# Altium project 003-00006.PrjPcb
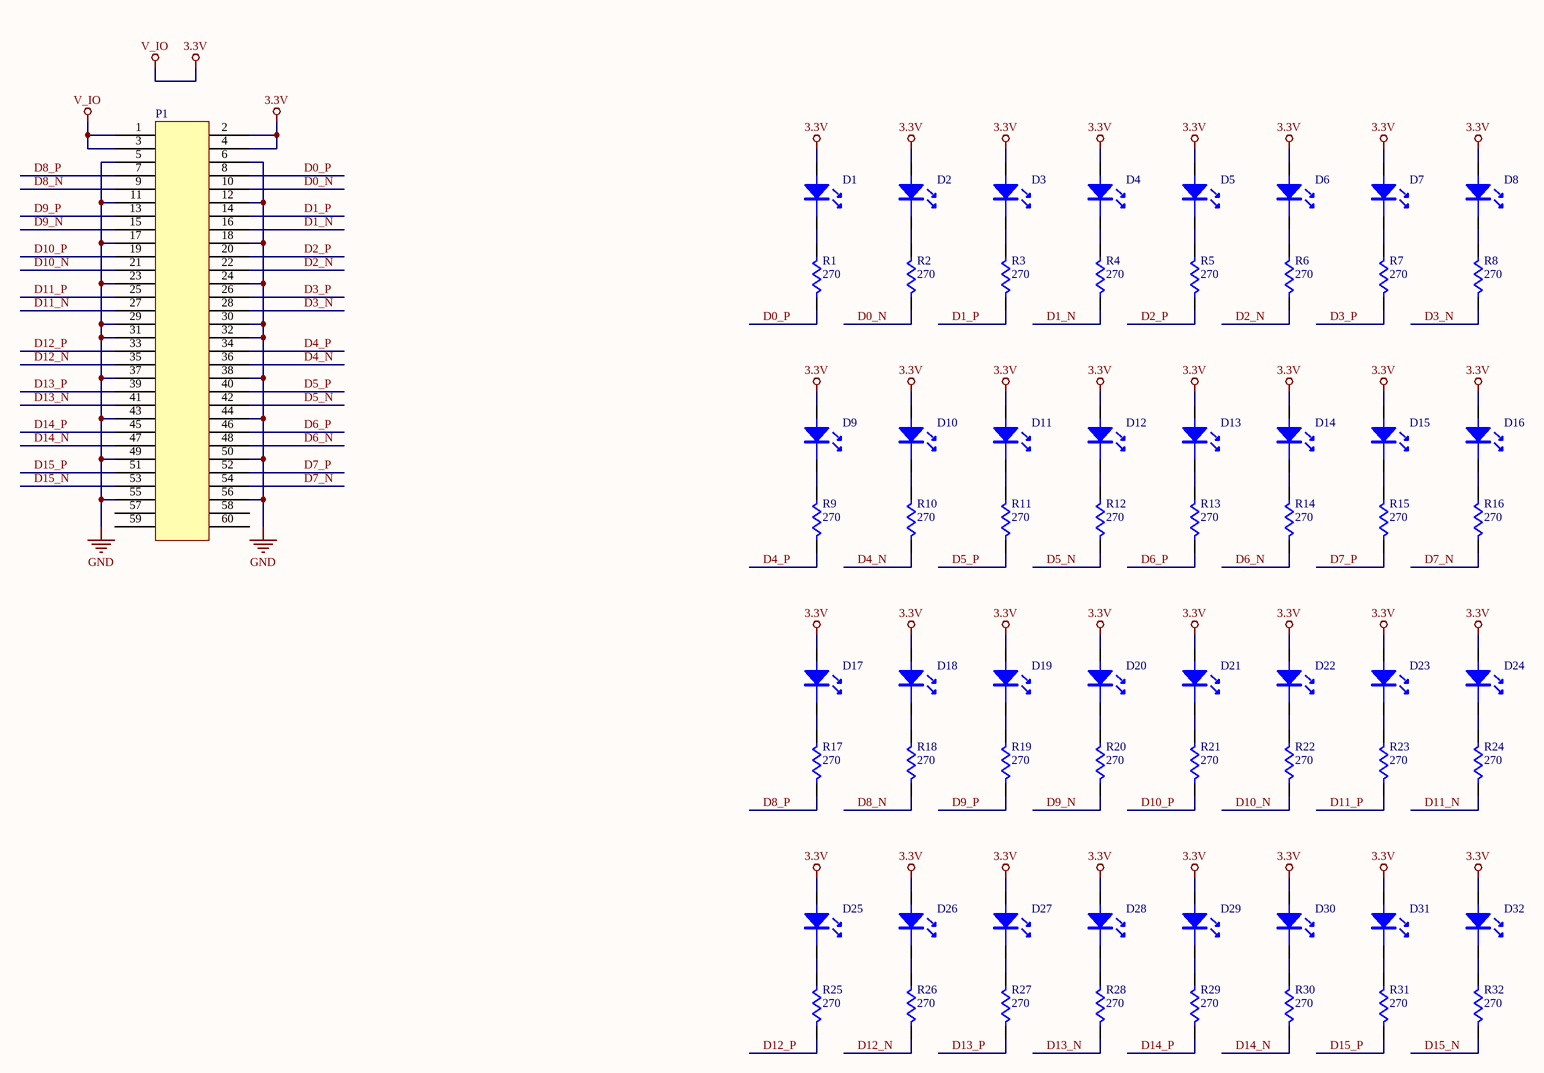
[diagram p0: 003-00006.SchDoc]
copyrightDate: 2014; DrillDrawingRevision: A; PCBPartNumber: 001-00006
1 sheet, 65 parts. Net scope: global (net labels, ports and power ports of the same name join across sheets).
Board file: 003-00006.PcbDoc

## Sheet 003-00006.SchDoc: <title>
size C; Organization: Custom Embedded Solutions, LLC.; Address1: 130 Oakland Trace; Address2: Madison, AL 35758; DocumentNumber: 1; Revision: <Rev>; SheetNumber: 1; SheetTotal: 5; PageTitle: Top Level (& only)

### Parts
D1  (no value)  [005-00018]
D2  (no value)  [005-00018]
D3  (no value)  [005-00018]
D4  (no value)  [005-00018]
D5  (no value)  [005-00018]
D6  (no value)  [005-00018]
D7  (no value)  [005-00018]
D8  (no value)  [005-00018]
D9  (no value)  [005-00018]
D10  (no value)  [005-00018]
D11  (no value)  [005-00018]
D12  (no value)  [005-00018]
D13  (no value)  [005-00018]
D14  (no value)  [005-00018]
D15  (no value)  [005-00018]
D16  (no value)  [005-00018]
D17  (no value)  [005-00018]
D18  (no value)  [005-00018]
D19  (no value)  [005-00018]
D20  (no value)  [005-00018]
D21  (no value)  [005-00018]
D22  (no value)  [005-00018]
D23  (no value)  [005-00018]
D24  (no value)  [005-00018]
D25  (no value)  [005-00018]
D26  (no value)  [005-00018]
D27  (no value)  [005-00018]
D28  (no value)  [005-00018]
D29  (no value)  [005-00018]
D30  (no value)  [005-00018]
D31  (no value)  [005-00018]
D32  (no value)  [005-00018]
P1  (no value)  [005-00024]  (no BOM)
R1  270  [005-00009]
R2  270  [005-00009]
R3  270  [005-00009]
R4  270  [005-00009]
R5  270  [005-00009]
R6  270  [005-00009]
R7  270  [005-00009]
R8  270  [005-00009]
R9  270  [005-00009]
R10  270  [005-00009]
R11  270  [005-00009]
R12  270  [005-00009]
R13  270  [005-00009]
R14  270  [005-00009]
R15  270  [005-00009]
R16  270  [005-00009]
R17  270  [005-00009]
R18  270  [005-00009]
R19  270  [005-00009]
R20  270  [005-00009]
R21  270  [005-00009]
R22  270  [005-00009]
R23  270  [005-00009]
R24  270  [005-00009]
R25  270  [005-00009]
R26  270  [005-00009]
R27  270  [005-00009]
R28  270  [005-00009]
R29  270  [005-00009]
R30  270  [005-00009]
R31  270  [005-00009]
R32  270  [005-00009]

### Nets
3.3V: D1.ANODE D2.ANODE D3.ANODE D4.ANODE D5.ANODE D6.ANODE D7.ANODE D8.ANODE D9.ANODE D10.ANODE D11.ANODE D12.ANODE D13.ANODE D14.ANODE D15.ANODE D16.ANODE D17.ANODE D18.ANODE D19.ANODE D20.ANODE D21.ANODE D22.ANODE D23.ANODE D24.ANODE D25.ANODE D26.ANODE D27.ANODE D28.ANODE D29.ANODE D30.ANODE D31.ANODE D32.ANODE P1.1 P1.2 P1.3 P1.4  [also labelled V_IO]
GND: P1.5 P1.6 P1.11 P1.12 P1.17 P1.18 P1.23 P1.24 P1.29 P1.30 P1.31 P1.32 P1.37 P1.38 P1.43 P1.44 P1.49 P1.50 P1.55 P1.56
D0_N: P1.10 R2.2
D0_P: P1.8 R1.2
D1_N: P1.16 R4.2
D1_P: P1.14 R3.2
D2_N: P1.22 R6.2
D2_P: P1.20 R5.2
D3_N: P1.28 R8.2
D3_P: P1.26 R7.2
D4_N: P1.36 R10.2
D4_P: P1.34 R9.2
D5_N: P1.42 R12.2
D5_P: P1.40 R11.2
D6_N: P1.48 R14.2
D6_P: P1.46 R13.2
D7_N: P1.54 R16.2
D7_P: P1.52 R15.2
D8_N: P1.9 R18.2
D8_P: P1.7 R17.2
D9_N: P1.15 R20.2
D9_P: P1.13 R19.2
D10_N: P1.21 R22.2
D10_P: P1.19 R21.2
D11_N: P1.27 R24.2
D11_P: P1.25 R23.2
D12_N: P1.35 R26.2
D12_P: P1.33 R25.2
D13_N: P1.41 R28.2
D13_P: P1.39 R27.2
D14_N: P1.47 R30.2
D14_P: P1.45 R29.2
D15_N: P1.53 R32.2
D15_P: P1.51 R31.2
NetD1_CATHODE: D1.CATHODE R1.1
NetD2_CATHODE: D2.CATHODE R2.1
NetD3_CATHODE: D3.CATHODE R3.1
NetD4_CATHODE: D4.CATHODE R4.1
NetD5_CATHODE: D5.CATHODE R5.1
NetD6_CATHODE: D6.CATHODE R6.1
NetD7_CATHODE: D7.CATHODE R7.1
NetD8_CATHODE: D8.CATHODE R8.1
NetD9_CATHODE: D9.CATHODE R9.1
NetD10_CATHODE: D10.CATHODE R10.1
NetD11_CATHODE: D11.CATHODE R11.1
NetD12_CATHODE: D12.CATHODE R12.1
NetD13_CATHODE: D13.CATHODE R13.1
NetD14_CATHODE: D14.CATHODE R14.1
NetD15_CATHODE: D15.CATHODE R15.1
NetD16_CATHODE: D16.CATHODE R16.1
NetD17_CATHODE: D17.CATHODE R17.1
NetD18_CATHODE: D18.CATHODE R18.1
NetD19_CATHODE: D19.CATHODE R19.1
NetD20_CATHODE: D20.CATHODE R20.1
NetD21_CATHODE: D21.CATHODE R21.1
NetD22_CATHODE: D22.CATHODE R22.1
NetD23_CATHODE: D23.CATHODE R23.1
NetD24_CATHODE: D24.CATHODE R24.1
NetD25_CATHODE: D25.CATHODE R25.1
NetD26_CATHODE: D26.CATHODE R26.1
NetD27_CATHODE: D27.CATHODE R27.1
NetD28_CATHODE: D28.CATHODE R28.1
NetD29_CATHODE: D29.CATHODE R29.1
NetD30_CATHODE: D30.CATHODE R30.1
NetD31_CATHODE: D31.CATHODE R31.1
NetD32_CATHODE: D32.CATHODE R32.1

Not connected (* = marked no-connect by the designer): P1 57 58 59 60

### Notes on the sheet
- Copyright (c)
- Page Title
- Design Title
- Creative Commons License, http://creativecommons.org/licenses/by/4.0/legalcode
  This PCB design by Custom Embedded Solutions, LLC. is licensed under a Creative Commons Attribution 4.0 International License.
- Size:
- Date:
- File:
- C
- Document Number:
- Time:
- Sheet
- Rev:
- of

### Library data of the parts
D1-D32 = 013-00003: LED Green SMD 20mA 2.2V 0603; Manufacturer1: Osram; Manufacturer1 Part Number: LG Q971-KN-1; F1: PNP; Preferred: Yes; Part Number: 013-00003; Current: 20mA; Voltage: 2.2V; Type: LED; Package: 0603, LED
P1 = 008-00005: Connector, PCB edge, MEC8, 30x2 Pin; Part Number: 008-00005; Package: Edge Connector, MEC8-30
R1-R32 = 009-00022: RES 270 OHM 1/16W 5% 0402; Manufacturer1: Stackpole Electronics; Manufacturer1 Part Number: RMCF0402JT270R; Tolerance: 0.05; Part Number: 009-00022; Power: 1/16W; Value: 270; Package: 1005, EIA 0402, Chip Resistor, 2-Leads, Body 1.00x0.50mm, IPC High Density

## Assembly variants
003-00006: all parts fitted